# EAGLE schematic S5D3_Footprint (EAGLE 9.6.2)
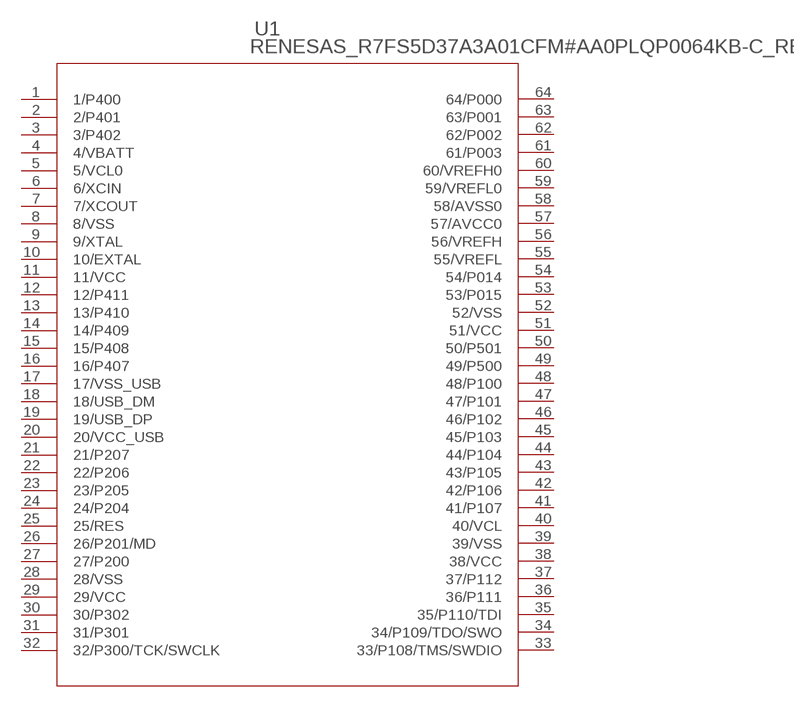
[diagram p0: schematic, sheet 1]

## Parts
U1  RENESAS_R7FS5D37A3A01CFM#AA0PLQP0064KB-C_REN-M  [PLQP0064KB-C_REN-M]
Unconnected: U1.1(1/P400) U1.2(2/P401) U1.3(3/P402) U1.6(6/XCIN) U1.7(7/XCOUT) U1.9(9/XTAL) U1.10(10/EXTAL) U1.12(12/P411) U1.13(13/P410) U1.14(14/P409) U1.15(15/P408) U1.16(16/P407) U1.18(18/USB_DM) U1.19(19/USB_DP) U1.22(22/P206) U1.23(23/P205) U1.24(24/P204) U1.25(25/RES) U1.26(26/P201/MD) U1.27(27/P200) U1.28(28/VSS) U1.29(29/VCC) U1.30(30/P302) U1.31(31/P301) U1.32(32/P300/TCK/SWCLK) U1.33(33/P108/TMS/SWDIO) U1.34(34/P109/TDO/SWO) U1.35(35/P110/TDI) U1.36(36/P111) U1.37(37/P112) U1.38(38/VCC) U1.41(41/P107) U1.42(42/P106) U1.43(43/P105) U1.44(44/P104) U1.45(45/P103) U1.46(46/P102) U1.47(47/P101) U1.48(48/P100) U1.49(49/P500) U1.50(50/P501) U1.51(51/VCC) U1.52(52/VSS) U1.53(53/P015) U1.54(54/P014) U1.55(55/VREFL) U1.58(58/AVSS0) U1.59(59/VREFL0) U1.60(60/VREFH0) U1.61(61/P003) U1.62(62/P002) U1.63(63/P001) U1.64(64/P000)

## Power pins joined to a net without a drawn wire
4/VBATT: U1.4(4/VBATT)
5/VCL0: U1.5(5/VCL0)
8/VSS: U1.8(8/VSS)
11/VCC: U1.11(11/VCC)
17/VSS_USB: U1.17(17/VSS_USB)
20/VCC_USB: U1.20(20/VCC_USB)
21/P207: U1.21(21/P207)
39/VSS: U1.39(39/VSS)
40/VCL: U1.40(40/VCL)
56/VREFH: U1.56(56/VREFH)
57/AVCC0: U1.57(57/AVCC0)

## Library data of the parts
U1 = 3D_MIG_Controller:RENESAS_R7FS5D37A3A01CFM#AA0; COPYRIGHT: Copyright (C) 2023 Ultra Librarian. All rights reserved.; MFR_NAME: Renesas Electronics; PARTNO: R7FS3A37A3A01CFM#AA0